# EAGLE design pneuBoard_rev3 (EAGLE 7.6.0)
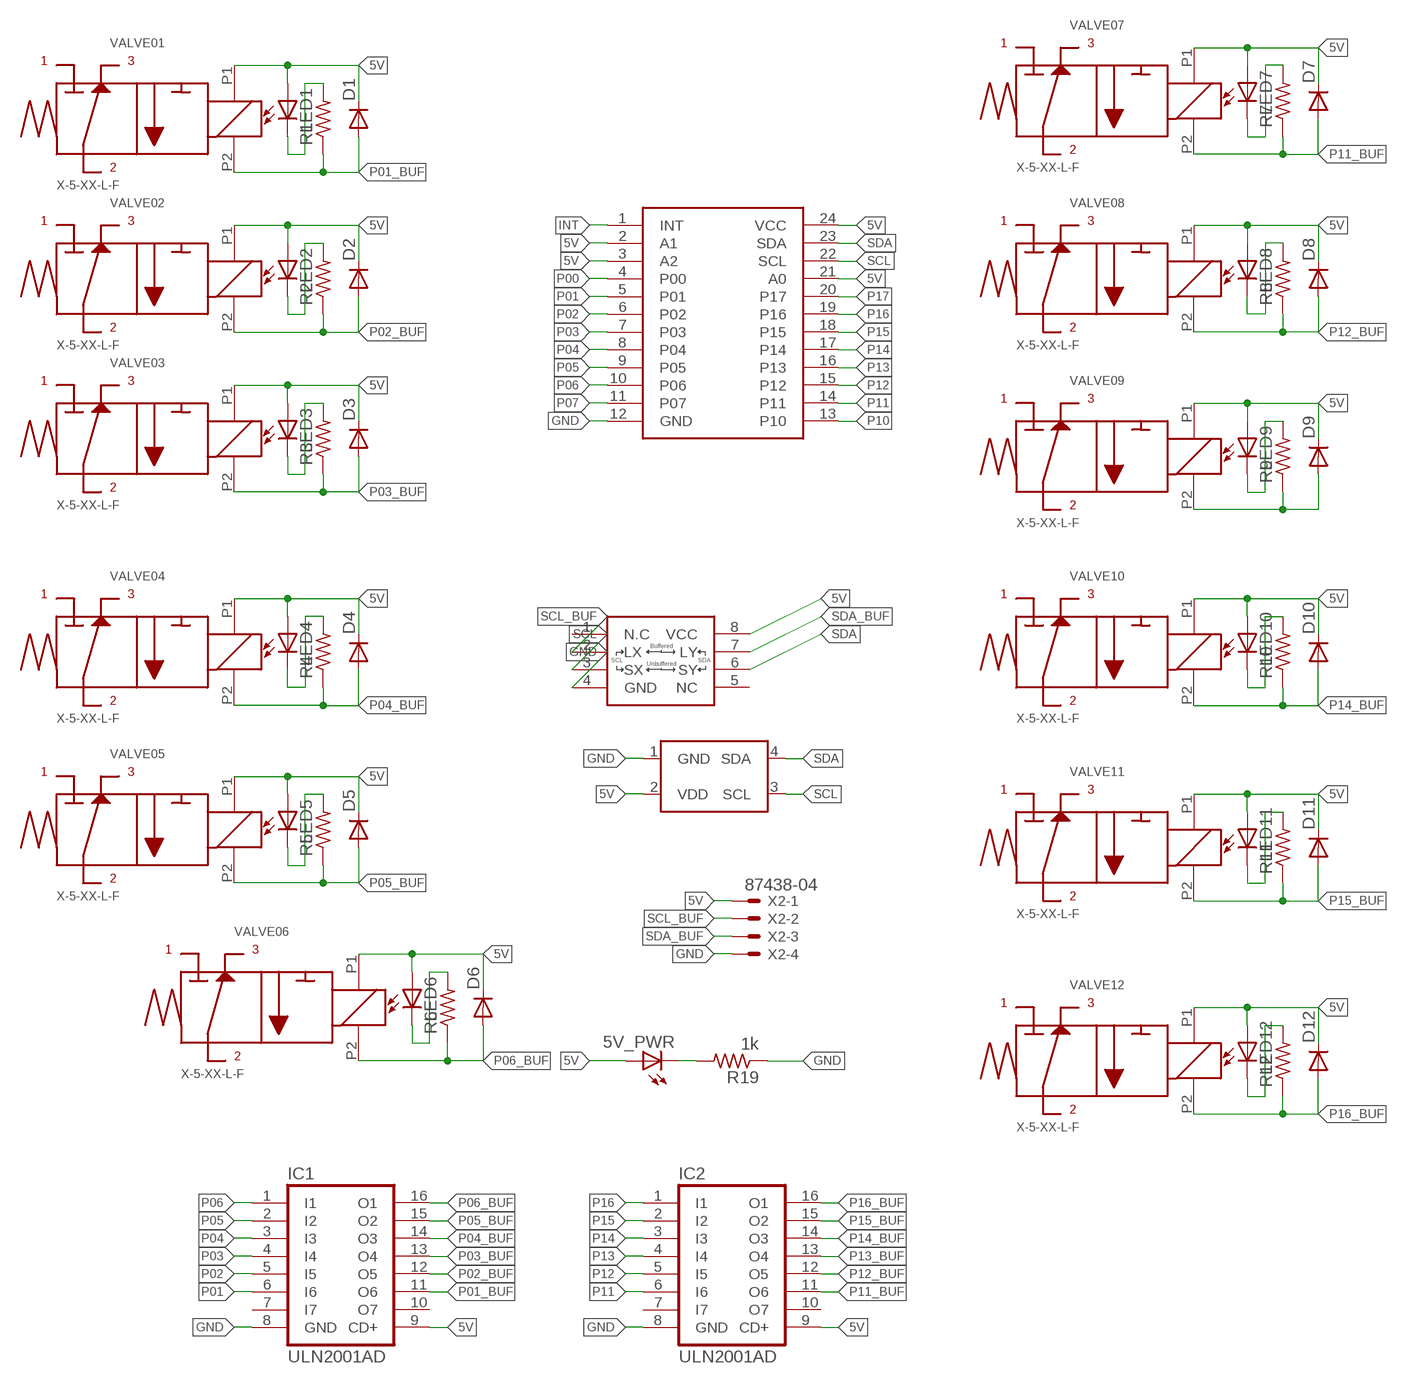
[diagram p0: schematic, sheet 1]

## Parts
5V_PWR  LEDSML1206  [SML1206]
D1  DIODE-SOD123  [SOD123]
D2  DIODE-SOD123  [SOD123]
D3  DIODE-SOD123  [SOD123]
D4  DIODE-SOD123  [SOD123]
D5  DIODE-SOD123  [SOD123]
D6  DIODE-SOD123  [SOD123]
D7  DIODE-SOD123  [SOD123]
D8  DIODE-SOD123  [SOD123]
D9  DIODE-SOD123  [SOD123]
D10  DIODE-SOD123  [SOD123]
D11  DIODE-SOD123  [SOD123]
D12  DIODE-SOD123  [SOD123]
IC1  ULN2001AD  [SO16]
IC2  ULN2001AD  [SO16]
LED1  LEDCHIPLED_1206  [CHIPLED_1206]
LED2  LEDCHIPLED_1206  [CHIPLED_1206]
LED3  LEDCHIPLED_1206  [CHIPLED_1206]
LED4  LEDCHIPLED_1206  [CHIPLED_1206]
LED5  LEDCHIPLED_1206  [CHIPLED_1206]
LED6  LEDCHIPLED_1206  [CHIPLED_1206]
LED7  LEDCHIPLED_1206  [CHIPLED_1206]
LED8  LEDCHIPLED_1206  [CHIPLED_1206]
LED9  LEDCHIPLED_1206  [CHIPLED_1206]
LED10  LEDCHIPLED_1206  [CHIPLED_1206]
LED11  LEDCHIPLED_1206  [CHIPLED_1206]
LED12  LEDCHIPLED_1206  [CHIPLED_1206]
R1  R-US_R0603  [R0603]
R2  R-US_R0603  [R0603]
R3  R-US_R0603  [R0603]
R4  R-US_R0603  [R0603]
R5  R-US_R0603  [R0603]
R6  R-US_R0603  [R0603]
R7  R-US_R0603  [R0603]
R8  R-US_R0603  [R0603]
R9  R-US_R0603  [R0603]
R10  R-US_R0603  [R0603]
R11  R-US_R0603  [R0603]
R12  R-US_R0603  [R0603]
R19  1k  R-US_R0603  [R0603]
U$1  PCF8575C  [PW_R-PDSO-G24]
U$2  P82B715  [SO8]
U$3  MS5837-30BA  [MS5837-30BA]
VALVE01  X-5-XX-L-F  [X-SERIES]
VALVE02  X-5-XX-L-F  [X-SERIES]
VALVE03  X-5-XX-L-F  [X-SERIES]
VALVE04  X-5-XX-L-F  [X-SERIES]
VALVE05  X-5-XX-L-F  [X-SERIES]
VALVE06  X-5-XX-L-F  [X-SERIES]
VALVE07  X-5-XX-L-F  [X-SERIES]
VALVE08  X-5-XX-L-F  [X-SERIES]
VALVE09  X-5-XX-L-F  [X-SERIES]
VALVE10  X-5-XX-L-F  [X-SERIES]
VALVE11  X-5-XX-L-F  [X-SERIES]
VALVE12  X-5-XX-L-F  [X-SERIES]
X2  87438-04  [87438-04]

## Nets
5V: 5V_PWR.A D1.C D2.C D3.C D4.C D5.C D6.C D7.C D8.C D9.C D10.C D11.C D12.C IC1.9(CD+) IC2.9(CD+) LED1.A LED2.A LED3.A LED4.A LED5.A LED6.A LED7.A LED8.A LED9.A LED10.A LED11.A LED12.A U$1.2(A1) U$1.3(A2) U$1.21(A0) U$1.24(VCC) U$2.8(VCC) U$3.2(VDD) VALVE01.P1 VALVE02.P1 VALVE03.P1 VALVE04.P1 VALVE05.P1 VALVE06.P1 VALVE07.P1 VALVE08.P1 VALVE09.P1 VALVE10.P1 VALVE11.P1 VALVE12.P1 X2.1
5V_LED: 5V_PWR.C R19.2
GND: IC1.8(GND) IC2.8(GND) R19.1 U$1.12(GND) U$2.4(GND) U$3.1(GND) X2.4
INT: U$1.1(INT)
N$2: LED4.C R4.2
N$4: LED5.C R5.2
N$5: LED6.C R6.2
N$7: LED1.C R1.2
N$8: LED2.C R2.2
N$9: LED3.C R3.2
N$11: LED7.C R7.2
N$13: LED8.C R8.2
N$14: LED9.C R9.2
N$19: LED10.C R10.2
N$21: LED11.C R11.2
N$23: LED12.C R12.2
P00: U$1.4(P00)
P01: IC1.6(I6) U$1.5(P01)
P01_BUF: D1.A IC1.11(O6) R1.1 VALVE01.P2
P02: IC1.5(I5) U$1.6(P02)
P02_BUF: D2.A IC1.12(O5) R2.1 VALVE02.P2
P03: IC1.4(I4) U$1.7(P03)
P03_BUF: D3.A IC1.13(O4) R3.1 VALVE03.P2
P04: IC1.3(I3) U$1.8(P04)
P04_BUF: D4.A IC1.14(O3) R4.1 VALVE04.P2
P05: IC1.2(I2) U$1.9(P05)
P05_BUF: D5.A IC1.15(O2) R5.1 VALVE05.P2
P06: IC1.1(I1) U$1.10(P06)
P06_BUF: D6.A IC1.16(O1) R6.1 VALVE06.P2
P07: U$1.11(P07)
P10: U$1.13(P10)
P11: IC2.6(I6) U$1.14(P11)
P11_BUF: D7.A IC2.11(O6) R7.1 VALVE07.P2
P12: IC2.5(I5) U$1.15(P12)
P12_BUF: D8.A IC2.12(O5) R8.1 VALVE08.P2
P13: IC2.4(I4) U$1.16(P13)
P13_BUF: D9.A IC2.13(O4) R9.1 VALVE09.P2
P14: IC2.3(I3) U$1.17(P14)
P14_BUF: D10.A IC2.14(O3) R10.1 VALVE10.P2
P15: IC2.2(I2) U$1.18(P15)
P15_BUF: D11.A IC2.15(O2) R11.1 VALVE11.P2
P16: IC2.1(I1) U$1.19(P16)
P16_BUF: D12.A IC2.16(O1) R12.1 VALVE12.P2
P17: U$1.20(P17)
SCL: U$1.22(SCL) U$2.3(SX) U$3.3(SCL)
SCL_BUF: U$2.2(LX) X2.2
SDA: U$1.23(SDA) U$2.6(SY) U$3.4(SDA)
SDA_BUF: U$2.7(LY) X2.3
Unconnected: IC1.7(I7) IC1.10(O7) IC2.7(I7) IC2.10(O7) U$2.1(N.C) U$2.5(NC)

## Library data of the parts
5V_PWR LED1-LED12 = led:LED: LED OSRAM: - CHIPLED LG R971, LG N971, LY N971, LG Q971, LY Q971, LO R971, LY R971 LH N974, LH R974 LS Q976, LO Q976, LY Q976 LO Q996 - Hyper CHIPLED LW Q18S LB Q993, LB Q99A, LB R99A - SideLED LS A670, LO A670, LY A670, LG A670, LP A670 LB A673, LV A673, LT A673, LW A673 LH A674 LY A675 LS A676, LA A676, LO A676, LY A676, LW A676 LS A679, LY A679, LG A679 - Hyper Micro SIDELED® LS Y876, LA Y876, LO Y876, LY Y876 LT Y87S - SmartLED LW L88C, LW L88S LB L89C, LB L89S, LG L890 LS L89K, LO L89K, LY L89K LS L896, LA L896, LO L896, LY L896 - TOPLED LS T670, LO T670, LY T670, LG T670, LP T670 LSG T670, LSP T670, LSY T670, LOP T670, LYG T670 LG T671, LOG T671, LSG T671 LB T673, LV T673, LT T673, LW T673 LH T674 LS T676, LA T676, LO T676, LY T676, LB T676, LH T676, LSB T676, LW T676 LB T67C, LV T67C, LT T67C, LS T67K, LO T67K, LY T67K, LW E67C LS E67B, LA E67B, LO E67B, LY E67B, LB E67C, LV E67C, LT E67C LW T67C LS T679, LY T679, LG T679 LS T770, LO T770, LY T770, LG T770, LP T770 LB T773, LV T773, LT T773, LW T773 LH T774 LS E675, LA E675, LY E675, LS T675 LS T776, LA T776, LO T776, LY T776, LB T776 LHGB T686 LT T68C, LB T68C - Hyper Mini TOPLED® LB M676 - Mini TOPLED Santana® LG M470 LS M47K, LO M47K, LY M47K Source: http://www.osram.convergy.de LUXEON: - LUMILED® LXK2-PW12-R00, LXK2-PW12-S00, LXK2-PW14-U00, LXK2-PW14-V00 LXK2-PM12-R00, LXK2-PM12-S00, LXK2-PM14-U00 LXK2-PE12-Q00, LXK2-PE12-R00, LXK2-PE12-S00, LXK2-PE14-T00, LXK2-PE14-U00 LXK2-PB12-K00, LXK2-PB12-L00, LXK2-PB12-M00, LXK2-PB14-N00, LXK2-PB14-P00, LXK2-PB14-Q00 LXK2-PR12-L00, LXK2-PR12-M00, LXK2-PR14-Q00, LXK2-PR14-R00 LXK2-PD12-Q00, LXK2-PD12-R00, LXK2-PD12-S00 LXK2-PH12-R00, LXK2-PH12-S00 LXK2-PL12-P00, LXK2-PL12-Q00, LXK2-PL12-R00 Source: www.luxeon.com KINGBRIGHT: KA-3528ASYC Source: www.kingbright.com
D1-D12 = diode:DIODE-: DIODE
IC1 IC2 = uln-udn:ULN2001A: DRIVER ARRAY
R1-R12 R19 = resistor:R-US_: RESISTOR, American symbol
U$1 = texas:PCF8575C: Remote 16 Bit I2C IO Expander
U$2 = nxp:P82B715
U$3 = te_connectivity:MS5837-30BA
VALVE01-VALVE09 VALVE10-VALVE12 = ParkerFludics:X-5-XX-L-F
X2 = con-molex_MOD:87438-04: Wire-to-Board 1.50mm (.059") Pitch Header - Right Angle, SMT, Shrouded Source: http://www.molex.com/product/micro/87438.html; OC_FARNELL: unknown; OC_NEWARK: unknown

## Board
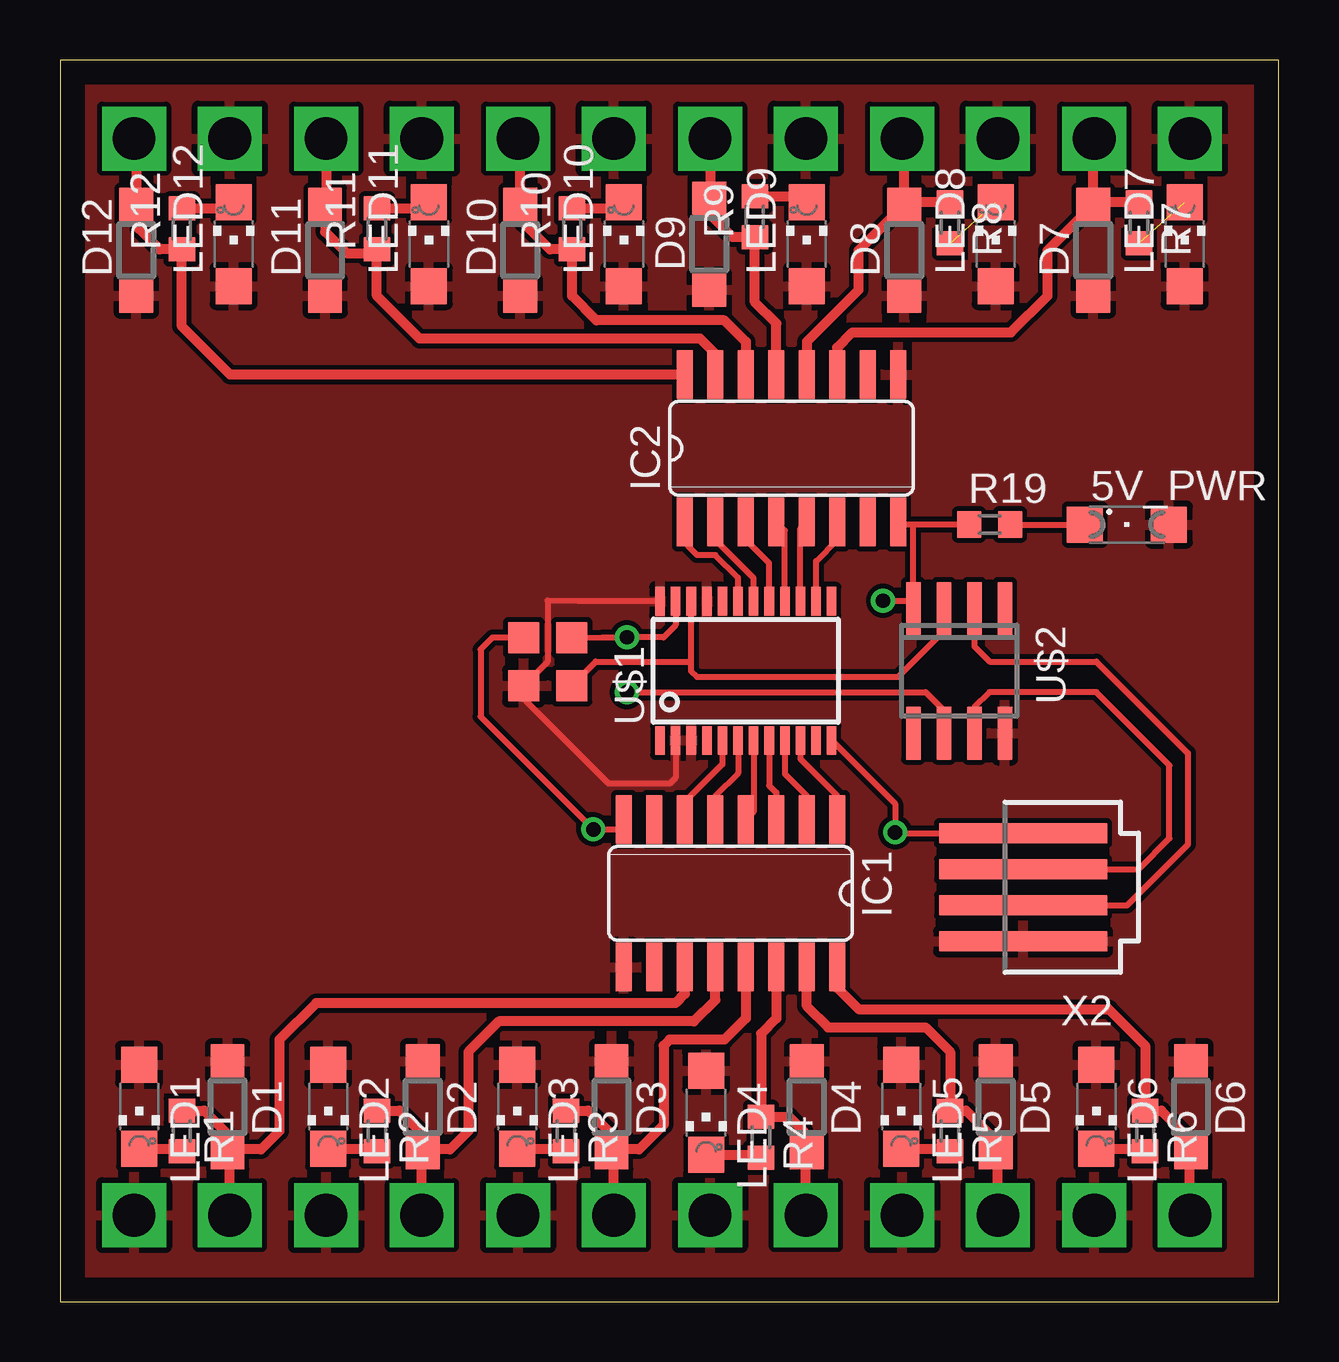
[diagram p1: board, top side]
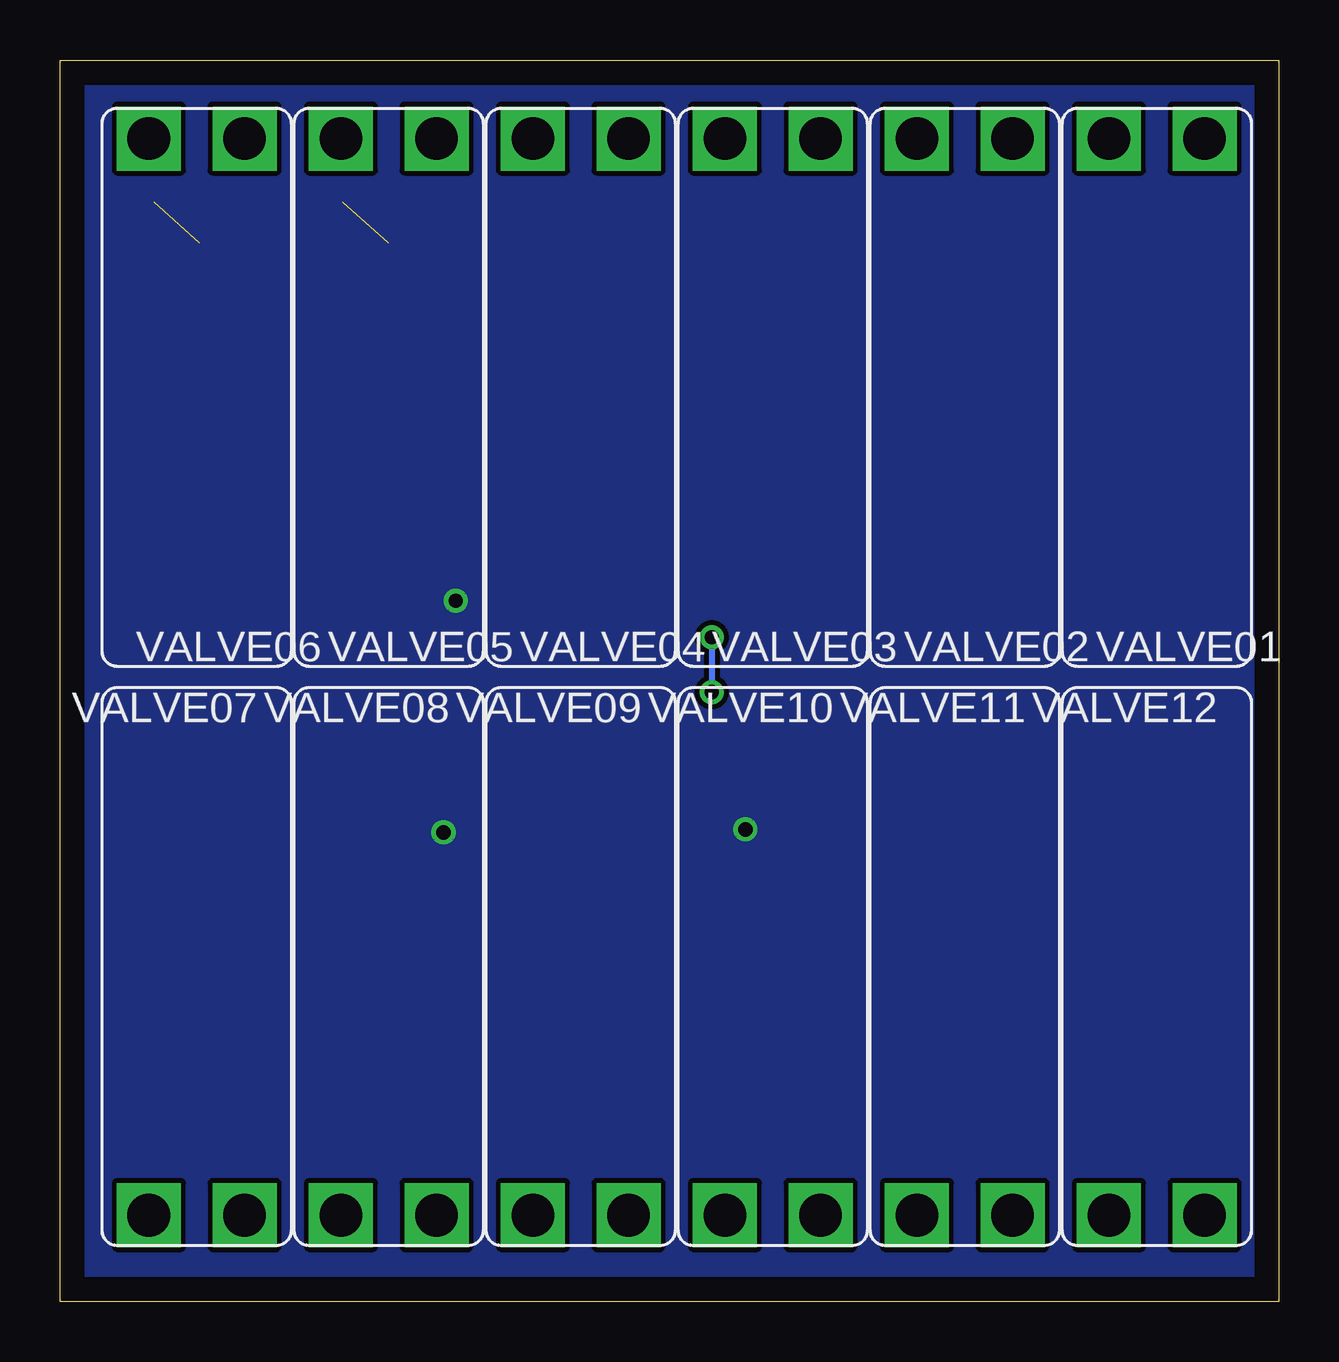
[diagram p2: board, bottom side, seen from below]

Size 50.78 x 51.74 mm. Coordinates in mm from the lower left corner, seen from the top.
Outline: 0,0 50.78,0 50.78,51.74 0,51.74 0,0
Copper layers (1*16): Top 0.035mm / dielectric 1.5mm / Bottom 0.035mm
Design rules "default": minimum track width 10mil, minimum drill 24mil, track to track 8mil, track to pad 8mil, pad to pad 8mil, via to via 8mil, smd to smd 8mil, copper to edge 40mil, drill to drill 8mil, minimum pad ring 10mil, minimum via ring 8mil, stop-mask expansion 4mil, vias tented up to drill 0mil, thermal gap 10mil

### Footprints (pad centres in the part's own frame; a part is rotated, then mirrored left to right if it is on the bottom)
SML1206 = smd 1.5 x 1.5: A 1.75,0; C -1.75,0
SOD123 = smd 1.4 x 1.4: A 1.9,0; C -1.9,0
SO16 = smd 0.66 x 2.032: 1 -4.445,-3.073; 2 -3.175,-3.073; 3 -1.905,-3.073; 4 -0.635,-3.073; 5 0.635,-3.073; 6 1.905,-3.073; 7 3.175,-3.073; 8 4.445,-3.073; 9 4.445,3.073; 10 3.175,3.073; 11 1.905,3.073; 12 0.635,3.073; 13 -0.635,3.073; 14 -1.905,3.073; 15 -3.175,3.073; 16 -4.445,3.073
CHIPLED_1206 = smd 1.5 x 1.5: A 0,-1.75; C 0,1.75
R0603 = smd 1 x 1.1: 1 -0.85,0; 2 0.85,0
PW_R-PDSO-G24 = smd 0.4 x 1.2: 1 -3.575,-2.9; 2 -2.925,-2.9; 3 -2.275,-2.9; 4 -1.625,-2.9; 5 -0.975,-2.9; 6 -0.325,-2.9; 7 0.325,-2.9; 8 0.975,-2.9; 9 1.625,-2.9; 10 2.275,-2.9; 11 2.925,-2.9; 12 3.575,-2.9; 13 3.575,2.9; 14 2.925,2.9; 15 2.275,2.9; 16 1.625,2.9; 17 0.975,2.9; 18 0.325,2.9; 19 -0.325,2.9; 20 -0.975,2.9; 21 -1.625,2.9; 22 -2.275,2.9; 23 -2.925,2.9; 24 -3.575,2.9
SO8 = smd 0.6 x 2.2: 1 -1.905,-2.6; 2 -0.635,-2.6; 3 0.635,-2.6; 4 1.905,-2.6; 5 1.905,2.6; 6 0.635,2.6; 7 -0.635,2.6; 8 -1.905,2.6
MS5837-30BA = smd 1.3 x 1.3: 1 -1,1; 2 -1,-1; 3 1,-1; 4 1,1
X-SERIES = drill 1.778 square: P1 10.363,1.994; P2 10.363,-1.994
87438-04 = smd 7 x 0.85: 1 0,2.25; 2 0,0.75; 3 0,-0.75; 4 0,-2.25

### Placement (x,y rotation side)
5V_PWR  44.45,32.38 0 top
D1  6.99,8.13 270 top
D2  15.11,8.13 270 top
D3  22.99,8.13 270 top
D4  31.11,8.13 270 top
D5  38.99,8.13 270 top
D6  47.12,8.13 270 top
D7  43.05,43.81 90 top
D8  35.18,43.81 90 top
D9  27.05,44.07 90 top
D10  19.18,43.81 90 top
D11  11.05,43.81 90 top
D12  3.17,43.81 90 top
IC1  27.94,17.02 180 top
IC2  30.48,35.56 0 top
LED1  3.3,8.13 180 top
LED2  11.18,8.13 180 top
LED3  19.05,8.13 180 top
LED4  26.92,7.87 180 top
LED5  35.05,8.13 180 top
LED6  43.18,8.13 180 top
LED7  46.86,44.07 0 top
LED8  38.99,44.07 0 top
LED9  31.11,44.07 0 top
LED10  23.5,44.07 0 top
LED11  15.37,44.07 0 top
LED12  7.24,44.07 0 top
R1  5.08,7.11 270 top
R2  13.21,7.11 270 top
R3  21.08,7.11 270 top
R4  29.21,6.86 270 top
R5  37.08,7.11 270 top
R6  45.21,7.11 270 top
R7  44.96,44.96 270 top
R8  37.08,44.96 270 top
R9  28.96,45.21 90 top
R10  21.34,44.7 90 top
R11  13.21,44.7 90 top
R12  5.08,44.7 90 top
R19  38.73,32.38 0 top
U$1  28.57,26.29 0 top
U$2  37.47,26.29 180 top
U$3  20.32,26.67 0 top
VALVE01  5.08,13.97 270 bottom
VALVE02  13.08,13.97 270 bottom
VALVE03  21.08,13.97 270 bottom
VALVE04  29.08,13.97 270 bottom
VALVE05  37.08,13.97 270 bottom
VALVE06  45.09,13.97 270 bottom
VALVE07  45.09,38.1 90 bottom
VALVE08  37.08,38.1 90 bottom
VALVE09  29.08,38.1 90 bottom
VALVE10  21.08,38.1 90 bottom
VALVE11  13.08,38.1 90 bottom
VALVE12  5.08,38.1 90 bottom
X2  40.13,17.27 180 top

### Tracks (layer width: path | path; a pad name or v marks a point on that pad's centre or on a via)
5V
  Top 0.254: U$1.24 21.61,29.19 20.32,29.21 20.32,26.67 U$3.2 19.05,25.4 22.86,21.59 25.4,21.59 25.65,21.84 U$1.2
  pour Top: 0,52.07 0,0 54.61,0 54.61,52.07
5V_LED
  Top 0.254: R19.2 5V_PWR.C
GND  (via drill 0.6)
  Top 0.254: U$2.4 35.56,29.21 | 35.56,29.21 35.56,32.38 | R19.1 35.56,32.38 | 35.56,32.38 35.03,32.38 IC2.8 | IC1.8 23.39,19.68 v22.23,19.68 17.53,24.38 17.53,27.18 18.02,27.67 U$3.1 | v34.29,29.21 35.56,29.21 | U$1.12 34.8,20.74 v34.8,19.56 34.83,19.52 X2.4
  pour Bottom: 0,52.07 0,0 53.34,0 53.34,52.07
N$2
  Top 0.406: LED4.C 29.09,6.12 R4.2
N$4
  Top 0.406: LED5.C 36.97,6.38 R5.2
N$5
  Top 0.406: LED6.C 45.1,6.38 R6.2
N$7
  Top 0.406: LED1.C 4.96,6.38 R1.2
N$8
  Top 0.406: LED2.C 13.09,6.38 R2.2
N$9
  Top 0.406: LED3.C 20.97,6.38 R3.2
N$11  (1 unrouted)
N$13  (1 unrouted)
N$14
  Top 0.406: R9.2 30.87,46.06 LED9.C
N$19
  Top 0.406: R10.2 23.48,45.55 LED10.C
N$21
  Top 0.406: R11.2 15.1,45.55 LED11.C
N$23
  Top 0.406: R12.2 6.97,45.55 LED12.C
P01
  Top 0.254: U$1.5 27.6,22.39 26.04,20.83 IC1.6
P01_BUF
  Top 0.406: IC1.11 26.04,12.83 25.65,12.45 10.67,12.45 9.14,10.92 9.14,7.11 8.38,6.35 7.11,6.35 D1.A | 6.99,3.61 VALVE01.P2 7.07,6.14 D1.A | R1.1 6.01,7.96 6.86,7.11 6.86,6.36 D1.A
P02
  Top 0.254: U$1.6 28.25,22.03 27.3,21.08 IC1.5
P02_BUF
  Top 0.406: IC1.12 27.3,12.57 26.42,11.68 18.29,11.68 17.02,10.41 17.02,7.11 16.26,6.35 15.23,6.35 D2.A | VALVE02.P2 15.07,6.19 D2.A | R2.1 14.14,7.96 14.99,7.11 14.99,6.36 D2.A
P03
  Top 0.254: U$1.7 28.9,20.42 IC1.4
P03_BUF
  Top 0.406: VALVE03.P2 23.08,6.14 D3.A | R3.1 22.01,7.96 22.86,7.11 22.86,6.36 D3.A | IC1.13 28.57,11.81 27.69,10.92 25.4,10.92 25.15,10.67 25.15,7.37 24.13,6.35 23.11,6.35 D3.A
P04
  Top 0.254: U$1.8 29.55,21.5 29.84,21.21 IC1.3
P04_BUF
  Top 0.406: VALVE04.P2 31.08,6.19 D4.A 30.99,6.36 30.99,7.11 30.39,7.71 R4.1 29.21,11.18 29.84,11.81 IC1.14
P05
  Top 0.254: U$1.9 30.2,22 31.11,21.08 IC1.2
P05_BUF
  Top 0.406: IC1.15 31.11,12.32 32,11.43 36.07,11.43 37.08,10.41 R5.1 37.76,7.96 38.86,6.86 38.86,6.36 D5.A 39.08,6.14 VALVE05.P2
P06
  Top 0.254: U$1.10 30.85,22.62 32.38,21.08 IC1.1
P06_BUF
  Top 0.406: IC1.16 32.38,13.08 33.27,12.19 43.69,12.19 45.21,10.67 R6.1 45.89,7.96 46.99,6.86 46.99,6.36 D6.A 47.08,6.19 VALVE06.P2
P11
  Top 0.254: U$1.14 31.5,30.86 32.38,31.75 IC2.6
P11_BUF
  Top 0.406: IC2.11 32.38,39.75 33.02,40.39 39.62,40.39 41.15,41.91 41.15,43.81 D7.A | D7.A 43.05,48.42 VALVE07.P2 | R7.1 43.15,45.81 D7.A
P12
  Top 0.254: U$1.15 30.85,32.22 IC2.5
P12_BUF
  Top 0.406: IC2.12 31.11,40.01 33.27,42.16 33.27,43.81 D8.A | R8.1 35.27,45.81 D8.A | D8.A 35.18,48.37 VALVE08.P2
P13
  Top 0.254: U$1.16 30.2,32.13 IC2.4
P13_BUF
  Top 0.406: VALVE09.P2 27.09,46.01 D9.A 27.18,45.84 27.18,45.21 28.03,44.36 R9.1 28.96,41.66 29.84,40.77 IC2.13
P14
  Top 0.254: U$1.17 29.55,30.77 28.57,31.75 IC2.3
P14_BUF
  Top 0.406: IC2.14 28.57,40.01 27.69,40.89 22.35,40.89 21.34,41.91 R10.1 20.41,43.85 19.3,44.96 19.3,45.59 D10.A 19.18,48.37 VALVE10.P2
P15
  Top 0.254: U$1.18 28.9,30.16 27.3,31.75 IC2.2
P15_BUF
  Top 0.406: IC2.15 27.3,39.5 26.67,40.13 14.99,40.13 13.21,41.91 R11.1 13.04,43.69 11.94,43.69 11.05,44.58 D11.A 11.09,45.75 VALVE11.P2
P16
  Top 0.254: U$1.19 28.25,30.17 27.3,31.11 26.54,31.11 26.16,31.5 26.16,32.51 IC2.1
P16_BUF
  Top 0.406: VALVE12.P2 3.17,48.46 D12.A 3.3,45.59 3.3,44.7 4.15,43.85 R12.1 5.08,40.64 7.09,38.63 IC2.16
SCL
  Top 0.254: U$2.3 36.83,27.94 34.92,26.04 26.54,26.04 26.3,26.28 26.3,26.67 | 26.3,26.67 U$1.22 | U$3.3 22.32,26.67 26.3,26.67
SCL_BUF
  Top 0.254: U$2.2 38.1,27.3 38.73,26.67 43.18,26.67 46.99,22.86 46.99,19.05 44.45,16.51 40.14,16.51 X2.2
SDA  (via drill 0.6)
  Top 0.254: v23.62,25.4 36.07,25.4 36.83,24.64 U$2.6 | U$3.4 22.61,27.69 v23.62,27.69 25.15,27.69 25.65,28.19 U$1.23
  Bottom 0.254: v23.62,27.69 v23.62,25.4
SDA_BUF
  Top 0.254: U$2.7 38.1,24.77 38.73,25.4 43.18,25.4 46.23,22.35 46.23,19.3 44.95,18.02 X2.3